# Altium schematic sheet Main.SchDoc
size A4; SheetNumber: 2; SheetTotal: 6
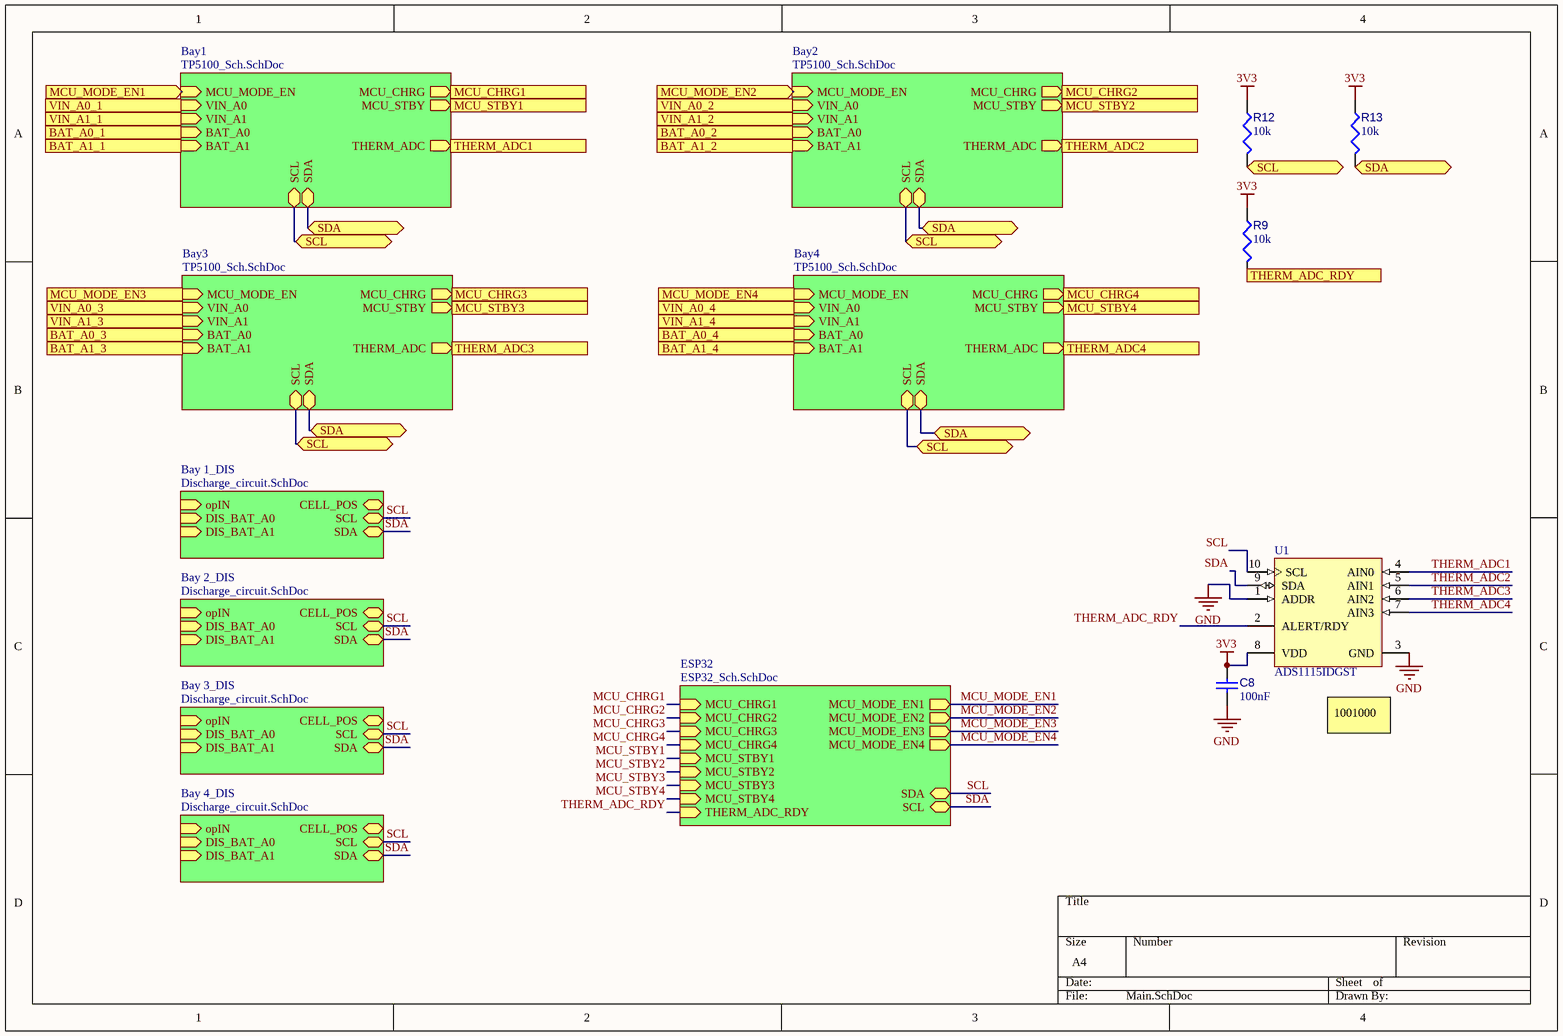
[diagram p0: Main.SchDoc]

## Parts
C8  value 100nF  [CAPC1005X56X25LL10T15]  (hidden comment: Capacitor 0.1 uF +/- 5% 16 V 0402)
R9  value 10k  [RESC0402(1005)_L]  (hidden comment: 10KR2F)
R12  value 10k  [RESC0402(1005)_L]  (hidden comment: 10KR2F)
R13  value 10k  [RESC0402(1005)_L]  (hidden comment: 10KR2F)
U1  ADS1115IDGST  [TI-DGS10_M]

## Sub-sheets
Bay1 = TP5100_Sch.SchDoc: MCU_MODE_EN (in), VIN_A0 (in), VIN_A1 (in), BAT_A0 (in), BAT_A1 (in), THERM_ADC (out), SCL (bidir), SDA (bidir), MCU_CHRG (out), MCU_STBY (out)
Bay2 = TP5100_Sch.SchDoc: MCU_MODE_EN (in), VIN_A0 (in), VIN_A1 (in), BAT_A0 (in), BAT_A1 (in), MCU_CHRG (out), MCU_STBY (out), THERM_ADC (out), SCL (bidir), SDA (bidir)
Bay3 = TP5100_Sch.SchDoc: MCU_MODE_EN (in), VIN_A0 (in), VIN_A1 (in), BAT_A0 (in), BAT_A1 (in), MCU_CHRG (out), MCU_STBY (out), THERM_ADC (out), SCL (bidir), SDA (bidir)
Bay4 = TP5100_Sch.SchDoc: MCU_MODE_EN (in), VIN_A0 (in), VIN_A1 (in), BAT_A0 (in), BAT_A1 (in), MCU_CHRG (out), MCU_STBY (out), THERM_ADC (out), SCL (bidir), SDA (bidir)
Bay 1_DIS = Discharge_circuit.SchDoc: opIN (in), DIS_BAT_A0 (in), DIS_BAT_A1 (in), CELL_POS (bidir), SCL (bidir), SDA (bidir)
Bay 2_DIS = Discharge_circuit.SchDoc: opIN (in), DIS_BAT_A0 (in), DIS_BAT_A1 (in), CELL_POS (bidir), SCL (bidir), SDA (bidir)
Bay 3_DIS = Discharge_circuit.SchDoc: opIN (in), DIS_BAT_A0 (in), DIS_BAT_A1 (in), CELL_POS (bidir), SCL (bidir), SDA (bidir)
Bay 4_DIS = Discharge_circuit.SchDoc: opIN (in), DIS_BAT_A0 (in), DIS_BAT_A1 (in), CELL_POS (bidir), SCL (bidir), SDA (bidir)
ESP32 = ESP32_Sch.SchDoc: MCU_MODE_EN1 (out), MCU_MODE_EN2 (out), MCU_MODE_EN3 (out), MCU_MODE_EN4 (out), MCU_CHRG1 (in), MCU_CHRG2 (in), MCU_CHRG3 (in), MCU_CHRG4 (in), MCU_STBY1 (in), MCU_STBY2 (in), MCU_STBY3 (in), MCU_STBY4 (in), THERM_ADC_RDY (in), SDA (bidir), SCL (bidir)

## Ports
BAT_A0_1 (in), BAT_A0_2 (in), BAT_A0_3 (in), BAT_A0_4 (in), BAT_A1_1 (in), BAT_A1_2 (in), BAT_A1_3 (in), BAT_A1_4 (in), MCU_CHRG1 (out), MCU_CHRG2 (out), MCU_CHRG3 (out), MCU_CHRG4 (out), MCU_MODE_EN1 (in), MCU_MODE_EN2 (in), MCU_MODE_EN3 (in), MCU_MODE_EN4 (in), MCU_STBY1 (out), MCU_STBY2 (out), MCU_STBY3 (out), MCU_STBY4 (out), SCL (bidir), SDA (bidir), THERM_ADC1 (out), THERM_ADC2 (out), THERM_ADC3 (out), THERM_ADC4 (out), THERM_ADC_RDY (out), VIN_A0_1 (in), VIN_A0_2 (in), VIN_A0_3 (in), VIN_A0_4 (in), VIN_A1_1 (in), VIN_A1_2 (in), VIN_A1_3 (in), VIN_A1_4 (in)

## Nets
3V3: C8.1 R9.1 R12.1 R13.1 U1.8(VDD)
GND: C8.2 U1.1(ADDR) U1.3(GND)
BAT_A0_1: port BAT_A0_1, sheet Bay1/BAT_A0
BAT_A0_2: port BAT_A0_2, sheet Bay2/BAT_A0
BAT_A0_3: port BAT_A0_3, sheet Bay3/BAT_A0
BAT_A0_4: port BAT_A0_4, sheet Bay4/BAT_A0
BAT_A1_1: port BAT_A1_1, sheet Bay1/BAT_A1
BAT_A1_2: port BAT_A1_2, sheet Bay2/BAT_A1
BAT_A1_3: port BAT_A1_3, sheet Bay3/BAT_A1
BAT_A1_4: port BAT_A1_4, sheet Bay4/BAT_A1
MCU_CHRG1: sheet ESP32/MCU_CHRG1
MCU_CHRG1: port MCU_CHRG1, sheet Bay1/MCU_CHRG  [a separate net that carries the same name]
MCU_CHRG2: sheet ESP32/MCU_CHRG2
MCU_CHRG2: port MCU_CHRG2, sheet Bay2/MCU_CHRG  [a separate net that carries the same name]
MCU_CHRG3: sheet ESP32/MCU_CHRG3
MCU_CHRG3: port MCU_CHRG3, sheet Bay3/MCU_CHRG  [a separate net that carries the same name]
MCU_CHRG4: sheet ESP32/MCU_CHRG4
MCU_CHRG4: port MCU_CHRG4, sheet Bay4/MCU_CHRG  [a separate net that carries the same name]
MCU_MODE_EN1: sheet ESP32/MCU_MODE_EN1
MCU_MODE_EN1: port MCU_MODE_EN1, sheet Bay1/MCU_MODE_EN  [a separate net that carries the same name]
MCU_MODE_EN2: sheet ESP32/MCU_MODE_EN2
MCU_MODE_EN2: port MCU_MODE_EN2, sheet Bay2/MCU_MODE_EN  [a separate net that carries the same name]
MCU_MODE_EN3: sheet ESP32/MCU_MODE_EN3
MCU_MODE_EN3: port MCU_MODE_EN3, sheet Bay3/MCU_MODE_EN  [a separate net that carries the same name]
MCU_MODE_EN4: sheet ESP32/MCU_MODE_EN4
MCU_MODE_EN4: port MCU_MODE_EN4, sheet Bay4/MCU_MODE_EN  [a separate net that carries the same name]
MCU_STBY1: sheet ESP32/MCU_STBY1
MCU_STBY1: port MCU_STBY1, sheet Bay1/MCU_STBY  [a separate net that carries the same name]
MCU_STBY2: sheet ESP32/MCU_STBY2
MCU_STBY2: port MCU_STBY2, sheet Bay2/MCU_STBY  [a separate net that carries the same name]
MCU_STBY3: sheet ESP32/MCU_STBY3
MCU_STBY3: port MCU_STBY3, sheet Bay3/MCU_STBY  [a separate net that carries the same name]
MCU_STBY4: sheet ESP32/MCU_STBY4
MCU_STBY4: port MCU_STBY4, sheet Bay4/MCU_STBY  [a separate net that carries the same name]
SCL: U1.10(SCL) ; sheet ESP32/SDA, sheet Bay 1_DIS/SCL, sheet Bay 2_DIS/SCL, sheet Bay 3_DIS/SCL, sheet Bay 4_DIS/SCL
SCL: R12.2 ; port SCL, sheet Bay1/SCL, sheet Bay2/SCL, sheet Bay3/SCL, sheet Bay4/SCL  [a separate net that carries the same name]
SDA: U1.9(SDA) ; sheet ESP32/SCL, sheet Bay 1_DIS/SDA, sheet Bay 2_DIS/SDA, sheet Bay 3_DIS/SDA, sheet Bay 4_DIS/SDA
SDA: R13.2 ; port SDA, sheet Bay1/SDA, sheet Bay2/SDA, sheet Bay3/SDA, sheet Bay4/SDA  [a separate net that carries the same name]
THERM_ADC1: U1.4(AIN0)
THERM_ADC1: port THERM_ADC1, sheet Bay1/THERM_ADC  [a separate net that carries the same name]
THERM_ADC2: U1.5(AIN1)
THERM_ADC2: port THERM_ADC2, sheet Bay2/THERM_ADC  [a separate net that carries the same name]
THERM_ADC3: U1.6(AIN2)
THERM_ADC3: port THERM_ADC3, sheet Bay3/THERM_ADC  [a separate net that carries the same name]
THERM_ADC4: U1.7(AIN3)
THERM_ADC4: port THERM_ADC4, sheet Bay4/THERM_ADC  [a separate net that carries the same name]
THERM_ADC_RDY: U1.2(ALERT/RDY) ; sheet ESP32/THERM_ADC_RDY
THERM_ADC_RDY: R9.2 ; port THERM_ADC_RDY  [a separate net that carries the same name]
VIN_A0_1: port VIN_A0_1, sheet Bay1/VIN_A0
VIN_A0_2: port VIN_A0_2, sheet Bay2/VIN_A0
VIN_A0_3: port VIN_A0_3, sheet Bay3/VIN_A0
VIN_A0_4: port VIN_A0_4, sheet Bay4/VIN_A0
VIN_A1_1: port VIN_A1_1, sheet Bay1/VIN_A1
VIN_A1_2: port VIN_A1_2, sheet Bay2/VIN_A1
VIN_A1_3: port VIN_A1_3, sheet Bay3/VIN_A1
VIN_A1_4: port VIN_A1_4, sheet Bay4/VIN_A1

## Notes on the sheet
- (near U1) 1001000

## Library data of the parts
C8 = CMP-001-00001-6: Chip Capacitor, 0.1 uF, +/- 5%, 16 V, 0402 (1005 Metric); Capacitor Type: Ceramic; Voltage Rating: 16V; Max Operating Temperature: 125°C; Min Operating Temperature: -55°C; Case/Package: 0402; Mounting Technology: SM; Pins: 2; Tolerance: 5%; RoHS Compliant: True
R9 R12 R13 = CMP-009-00066-2: 10K 0.063W 1% 0402 (1005 Metric)  SMD; Power: 63mW; Case/Package: 0402; Mounting Technology: SMT; Pins: 2; Tolerance: 1%
U1 = CMP-0003-00378-2: 16-Bit ADC with Integrated Multiplexer, PGA, Comparator, Oscillator, and Reference, -40 to 125 degC, 10-pin SOP (DGS10), Green (RoHS & no Sb/Br); Manufacturer: Texas Instruments; Sample Rate (max)(SPS): 860; SubFamily: Precision ADC (<=10MSPS); Architecture: Delta-Sigma; Digital Supply(Min)(V): 2; Resolution(Bits): 16; Digital Supply(Max)(V): 5.5; INL(Max)(+/-LSB): 1; Interface: Serial I2C; # Input Channels: 4; Eco-Plan: Green (RoHS & no Sb/Br); PackageDescription: 10-Pin Plastic Small Outline, Body 3 x 3 mm, Pitch 0.5 mm; Mounting Technology: Surface Mount; PackageReference: DGS10; DatasheetVersion: SBAS444B; ComponentLink3Description: Package Specification; ComponentLink1Description: Manufacturer URL; PartNumber: ADS1115IDGST; ComponentLink3URL: http://www.ti.com/lit/ml/mpds035b/mpds035b.pdf; ComponentLink2URL: http://www.ti.com/general/docs/lit/getliterature.tsp?genericPartNumber=ADS1115&fileType=pdf; Analog Voltage AV/DD(Min)(V): 2; ComponentLink2Description: Datasheet; PackageVersion: 4073272/C, 02/2004; Analog Voltage AV/DD(Max)(V): 5.5; Code_JEDEC: MO-153; ComponentLink1URL: http://www.ti.com/